# EAGLE design [Kirim Panut] Beton Ajek - Dirouting Faris (EAGLE 9.6.2)
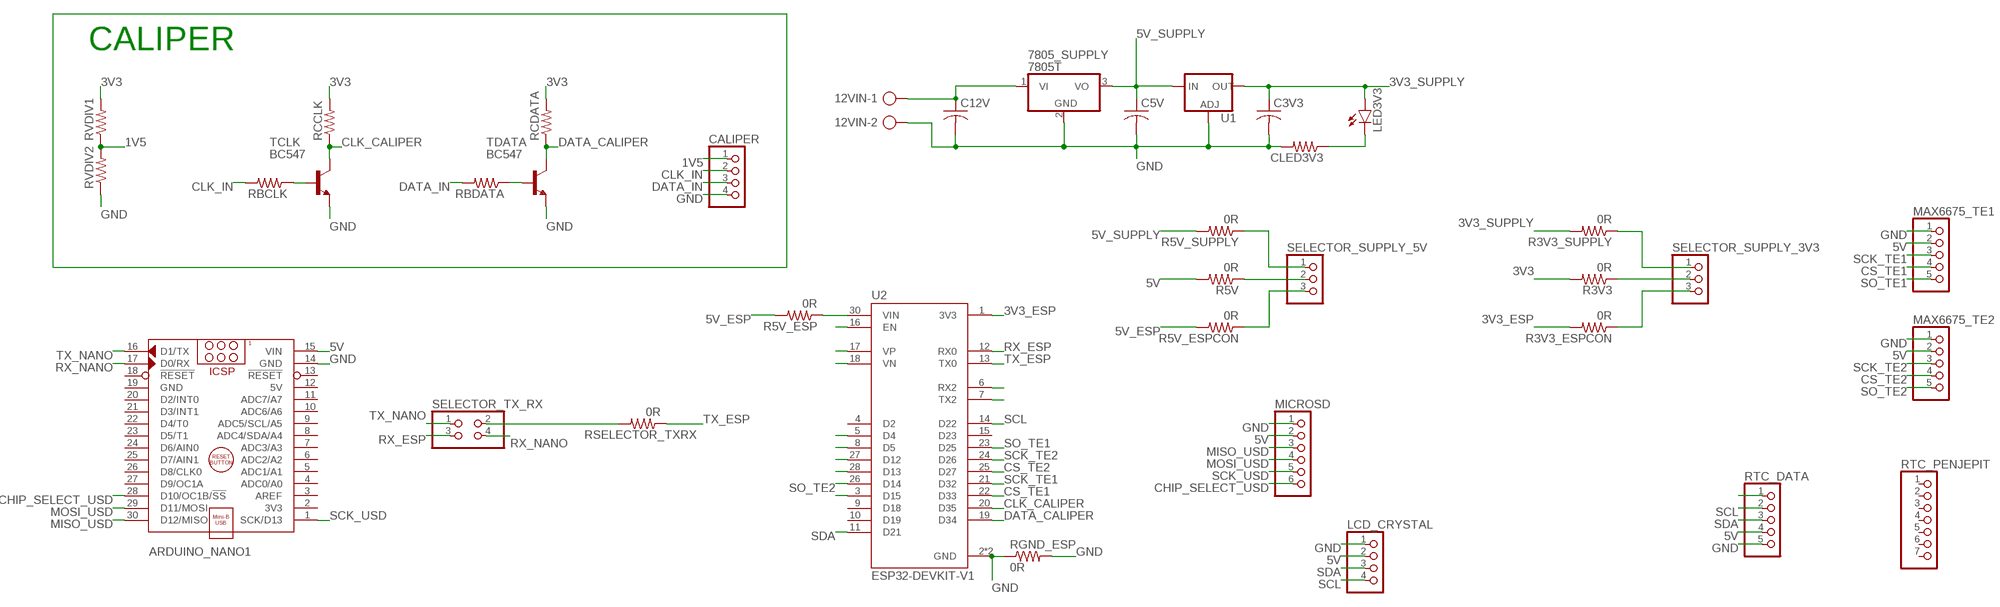
[diagram p0: schematic, sheet 1]

## Parts
12VIN  AK300/2  [AK300/2]
7805_SUPPLY  7805T  [TO220H]
ARDUINO_NANO1  ARDUINO_NANO  [ARDUINO_NANO]
C3V3  C-US075-032X103  [C075-032X103]
C5V  C-US075-032X103  [C075-032X103]
C12V  C-US075-032X103  [C075-032X103]
CALIPER  PINHD-1X4  [1X04]
CLED3V3  R-US_0207/10  [0207/10]
LCD_CRYSTAL  PINHD-1X4  [1X04]
LED3V3  LED5MM  [LED5MM]
MAX6675_TE1  PINHD-1X5  [1X05]
MAX6675_TE2  PINHD-1X5  [1X05]
MICROSD  PINHD-1X6  [1X06]
R3V3  0R  R-US_0207/10  [0207/10]
R3V3_ESPCON  0R  R-US_0207/10  [0207/10]
R3V3_SUPPLY  0R  R-US_0207/10  [0207/10]
R5V  0R  R-US_0207/10  [0207/10]
R5V_ESP  0R  R-US_0207/10  [0207/10]
R5V_ESPCON  0R  R-US_0207/10  [0207/10]
R5V_SUPPLY  0R  R-US_0207/10  [0207/10]
RBCLK  R-US_0207/10  [0207/10]
RBDATA  R-US_0207/10  [0207/10]
RCCLK  R-US_0207/10  [0207/10]
RCDATA  R-US_0207/10  [0207/10]
RGND_ESP  0R  R-US_0207/15  [0207/15]
RSELECTOR_TXRX  0R  R-US_0207/10  [0207/10]
RTC_DATA  PINHD-1X5  [1X05]
RTC_PENJEPIT  PINHD-1X7  [1X07]
RVDIV1  R-US_0207/10  [0207/10]
RVDIV2  R-US_0207/10  [0207/10]
SELECTOR_SUPPLY_3V3  PINHD-1X3  [1X03]
SELECTOR_SUPPLY_5V  PINHD-1X3  [1X03]
SELECTOR_TX_RX  PINHD-2X2  [2X02]
TCLK  BC547  [TO92]
TDATA  BC547  [TO92]
U1  V_REG_LM1117SOT223  [SOT223]
U2  ESP32-DEVKIT-V1  [MODULE_ESP32_DEVKIT_V1]

## Nets
1V5: CALIPER.1 RVDIV1.1 RVDIV2.2
3V3: R3V3.2 RCCLK.2 RCDATA.2 RVDIV1.2
3V3_ESP: R3V3_ESPCON.2 U2.1(3V3)
3V3_SUPPLY: C3V3.1 LED3V3.A R3V3_SUPPLY.2 U1.2(OUT) U1.4(OUT)
5V: ARDUINO_NANO1.15(VIN) LCD_CRYSTAL.2 MAX6675_TE1.2 MAX6675_TE2.2 MICROSD.2 R5V.2 RTC_DATA.4
5V_ESP: R5V_ESP.2 R5V_ESPCON.2
5V_SUPPLY: 7805_SUPPLY.3(VO) C5V.1 R5V_SUPPLY.2 U1.3(IN)
CHIP_SELECT_USD: ARDUINO_NANO1.28(D10/OC1B/!SS) MICROSD.6
CLK_CALIPER: RCCLK.1 TCLK.3(C) U2.20(D35)
CLK_IN: CALIPER.2 RBCLK.2
CS_TE1: MAX6675_TE1.4 U2.22(D33)
CS_TE2: MAX6675_TE2.4 U2.25(D27)
DATA_CALIPER: RCDATA.1 TDATA.3(C) U2.19(D34)
DATA_IN: CALIPER.3 RBDATA.2
GND: 12VIN.2 7805_SUPPLY.2(GND) ARDUINO_NANO1.14(GND) C3V3.2 C5V.2 C12V.2 CALIPER.4 CLED3V3.2 LCD_CRYSTAL.1 MAX6675_TE1.1 MAX6675_TE2.1 MICROSD.1 RGND_ESP.1 RGND_ESP.2 RTC_DATA.5 RVDIV2.1 TCLK.1(E) TDATA.1(E) U1.1(ADJ) U2.2(GND) U2.29(GND)
MISO_USD: ARDUINO_NANO1.30(D12/MISO) MICROSD.3
MOSI_USD: ARDUINO_NANO1.29(D11/MOSI) MICROSD.4
N$1: 12VIN.1 7805_SUPPLY.1(VI) C12V.1
N$2: RBCLK.1 TCLK.2(B)
N$4: RSELECTOR_TXRX.2 SELECTOR_TX_RX.2
N$6: R5V_ESP.1 U2.30(VIN)
N$7: R5V.1 SELECTOR_SUPPLY_5V.2
N$8: U2.16(EN)
N$9: U2.17(VP)
N$10: U2.18(VN)
N$11: R5V_SUPPLY.1 SELECTOR_SUPPLY_5V.1
N$12: U2.5(D4)
N$13: CLED3V3.1 LED3V3.K(C)
N$14: R5V_ESPCON.1 SELECTOR_SUPPLY_5V.3
N$15: R3V3.1 SELECTOR_SUPPLY_3V3.2
N$16: R3V3_SUPPLY.1 SELECTOR_SUPPLY_3V3.1
N$17: U2.8(D5)
N$18: RBDATA.1 TDATA.2(B)
N$19: U2.27(D12)
N$20: U2.28(D13)
N$21: R3V3_ESPCON.1 SELECTOR_SUPPLY_3V3.3
N$25: U2.3(D15)
N$39: U2.7(TX2)
N$40: U2.6(RX2)
N$52: RTC_DATA.1
RX_ESP: SELECTOR_TX_RX.3 U2.12(RX0)
RX_NANO: ARDUINO_NANO1.17(D0/RX) SELECTOR_TX_RX.4
SCK_TE1: MAX6675_TE1.3 U2.21(D32)
SCK_TE2: MAX6675_TE2.3 U2.24(D26)
SCK_USD: ARDUINO_NANO1.1(SCK/D13) MICROSD.5
SCL: LCD_CRYSTAL.4 RTC_DATA.2 U2.14(D22)
SDA: LCD_CRYSTAL.3 RTC_DATA.3 U2.11(D21)
SO_TE1: MAX6675_TE1.5 U2.23(D25)
SO_TE2: MAX6675_TE2.5 U2.26(D14)
TX_ESP: RSELECTOR_TXRX.1 U2.13(TX0)
TX_NANO: ARDUINO_NANO1.16(D1/TX) SELECTOR_TX_RX.1
Unconnected: ARDUINO_NANO1.2(3V3) ARDUINO_NANO1.3(AREF) ARDUINO_NANO1.4(ADC0/A0) ARDUINO_NANO1.5(ADC1/A1) ARDUINO_NANO1.6(ADC2/A2) ARDUINO_NANO1.7(ADC3/A3) ARDUINO_NANO1.8(ADC4/SDA/A4) ARDUINO_NANO1.9(ADC5/SCL/A5) ARDUINO_NANO1.10(ADC6/A6) ARDUINO_NANO1.11(ADC7/A7) ARDUINO_NANO1.13(!RESET) ARDUINO_NANO1.18(!RESET) ARDUINO_NANO1.20(D2/INT0) ARDUINO_NANO1.21(D3/INT1) ARDUINO_NANO1.22(D4/T0) ARDUINO_NANO1.23(D5/T1) ARDUINO_NANO1.24(D6/AIN0) ARDUINO_NANO1.25(D7/AIN1) ARDUINO_NANO1.26(D8/CLK0) ARDUINO_NANO1.27(D9/OC1A) RTC_PENJEPIT.1 RTC_PENJEPIT.2 RTC_PENJEPIT.3 RTC_PENJEPIT.4 RTC_PENJEPIT.5 RTC_PENJEPIT.6 RTC_PENJEPIT.7 U2.4(D2) U2.9(D18) U2.10(D19) U2.15(D23)

## Notes on the sheet
- CALIPER

## Power pins joined to a net without a drawn wire
5V: ARDUINO_NANO1.12(5V)
GND: ARDUINO_NANO1.19(GND)

## Library data of the parts
12VIN = con-ptr500:AK300/2: CONNECTOR
7805_SUPPLY = adafruit:78*: Positive VOLTAGE REGULATOR Added bigger pads to the TO-92 package
ARDUINO_NANO1 = ArduinoNanoV30:ARDUINO_NANO: Arduino Nano V3.0 Module Overview: The Arduino Nano is a small, complete, and breadboard-friendly board based on the ATmega328 (Arduino Nano 3.x) or ATmega168 (Arduino Nano 2.x). It has more or less the same functionality of the Arduino Duemilanove, but in a different package. It lacks only a DC power jack, and works with a Mini-B USB cable instead of a standard one. The Nano was designed and is being produced by Gravitech <http://www.gravitech.us/arna30wiatp.html>. General specifications: Item Value Microcontroller Atmel ATmega168 or ATmega328 Operating Voltage (logic level) 5 V Input Voltage (recommended) 7-12 V Input Voltage (limits) 6-20 V Digital I/O Pins 14 (of which 6 provide PWM output) Analog Input Pins 8 DC Current per I/O Pin 40 mA Flash Memory 16 KB (ATmega168) or 32 KB (ATmega328) of which 2 KB used by bootloader SRAM 1 KB (ATmega168) or 2 KB (ATmega328) EEPROM 512 bytes (ATmega168) or 1 KB (ATmega328) Clock Speed 16 MHz Dimensions (Inches) 0.73" x 1.70" Dimensions (mm) 18mm x 45mm Overall height About 9 mm (not including pins) Weigth 5 g Power: The Arduino Nano can be powered via the Mini-B USB connection, 6-20V unregulated external power supply (pin 30), or 5V regulated external power supply (pin 27). The power source is automatically selected to the highest voltage source. Memory: The ATmega168 has 16 KB of flash memory for storing code (of which 2 KB is used for the bootloader); the ATmega328 has 32 KB, (also with 2 KB used for the bootloader). The ATmega168 has 1 KB of SRAM and 512 bytes of EEPROM (which can be read and written with the EEPROM library); the ATmega328 has 2 KB of SRAM and 1 KB of EEPROM. Input and Output: Each of the 14 digital pins on the Nano can be used as an input or output, using pinMode(), digitalWrite(), and digitalRead() functions. They operate at 5 volts. Each pin can provide or receive a maximum of 40 mA and has an internal pull-up resistor (disconnected by default) of 20-50 kOhms. In addition, some pins have specialized functions. Visit Arduino - ArduinoBoardNano <https://www.arduino.cc/en/Main/ArduinoBoardNano>
C3V3 C5V C12V = rcl:C-US: CAPACITOR, American symbol; SPICEPREFIX: C
CALIPER LCD_CRYSTAL = pinhead:PINHD-1X4: PIN HEADER
CLED3V3 R3V3 R3V3_ESPCON R3V3_SUPPLY R5V R5V_ESP R5V_ESPCON R5V_SUPPLY RBCLK RBDATA RCCLK RCDATA RGND_ESP RSELECTOR_TXRX RVDIV1 RVDIV2 = rcl:R-US_: RESISTOR, American symbol; SPICEPREFIX: R
LED3V3 = led:LED: LED OSRAM: - CHIPLED LG R971, LG N971, LY N971, LG Q971, LY Q971, LO R971, LY R971 LH N974, LH R974 LS Q976, LO Q976, LY Q976 LO Q996 - Hyper CHIPLED LW Q18S LB Q993, LB Q99A, LB R99A - SideLED LS A670, LO A670, LY A670, LG A670, LP A670 LB A673, LV A673, LT A673, LW A673 LH A674 LY A675 LS A676, LA A676, LO A676, LY A676, LW A676 LS A679, LY A679, LG A679 - Hyper Micro SIDELED® LS Y876, LA Y876, LO Y876, LY Y876 LT Y87S - SmartLED LW L88C, LW L88S LB L89C, LB L89S, LG L890 LS L89K, LO L89K, LY L89K LS L896, LA L896, LO L896, LY L896 - TOPLED LS T670, LO T670, LY T670, LG T670, LP T670 LSG T670, LSP T670, LSY T670, LOP T670, LYG T670 LG T671, LOG T671, LSG T671 LB T673, LV T673, LT T673, LW T673 LH T674 LS T676, LA T676, LO T676, LY T676, LB T676, LH T676, LSB T676, LW T676 LB T67C, LV T67C, LT T67C, LS T67K, LO T67K, LY T67K, LW E67C LS E67B, LA E67B, LO E67B, LY E67B, LB E67C, LV E67C, LT E67C LW T67C LS T679, LY T679, LG T679 LS T770, LO T770, LY T770, LG T770, LP T770 LB T773, LV T773, LT T773, LW T773 LH T774 LS E675, LA E675, LY E675, LS T675 LS T776, LA T776, LO T776, LY T776, LB T776 LHGB T686 LT T68C, LB T68C - Hyper Mini TOPLED® LB M676 - Mini TOPLED Santana® LG M470 LS M47K, LO M47K, LY M47K Source: http://www.osram.convergy.de LUXEON: - LUMILED® LXK2-PW12-R00, LXK2-PW12-S00, LXK2-PW14-U00, LXK2-PW14-V00 LXK2-PM12-R00, LXK2-PM12-S00, LXK2-PM14-U00 LXK2-PE12-Q00, LXK2-PE12-R00, LXK2-PE12-S00, LXK2-PE14-T00, LXK2-PE14-U00 LXK2-PB12-K00, LXK2-PB12-L00, LXK2-PB12-M00, LXK2-PB14-N00, LXK2-PB14-P00, LXK2-PB14-Q00 LXK2-PR12-L00, LXK2-PR12-M00, LXK2-PR14-Q00, LXK2-PR14-R00 LXK2-PD12-Q00, LXK2-PD12-R00, LXK2-PD12-S00 LXK2-PH12-R00, LXK2-PH12-S00 LXK2-PL12-P00, LXK2-PL12-Q00, LXK2-PL12-R00 Source: www.luxeon.com KINGBRIGHT: KA-3528ASYC Source: www.kingbright.com
MAX6675_TE1 MAX6675_TE2 RTC_DATA = pinhead:PINHD-1X5: PIN HEADER
MICROSD = pinhead:PINHD-1X6: PIN HEADER
RTC_PENJEPIT = pinhead:PINHD-1X7: PIN HEADER
SELECTOR_SUPPLY_3V3 SELECTOR_SUPPLY_5V = pinhead:PINHD-1X3: PIN HEADER
SELECTOR_TX_RX = pinhead:PINHD-2X2: PIN HEADER
TCLK TDATA = transistor:BC547: NPN TRANSISTOR
U1 = SparkFun-IC-Power:V_REG_LM1117: Voltage Regulator LM1117 Standard adjustable voltage regulator but in SMD form. Spark Fun Electronics SKU : COM-00595; PROD_ID: VREG-08170
U2 = ESP32-DEVKIT-V1:ESP32-DEVKIT-V1: Dual core, Wi-Fi: 2.4 GHz up to 150 Mbits/s,BLE (Bluetooth Low Energy) and legacy Bluetooth, 32 bits, Up to 240 MHz Check availability <https://pricing.snapeda.com/parts/ESP32-DEVKIT-V1/Do%20it/view-part?ref=eda>; AVAILABILITY: Not in stock; DESCRIPTION: Dual core, Wi-Fi: 2.4 GHz up to 150 Mbits/s,BLE (Bluetooth Low Energy) and legacy Bluetooth, 32 bits, Up to 240 MHz; MF: Do it; MP: ESP32-DEVKIT-V1; PACKAGE: None; PRICE: None

## Board
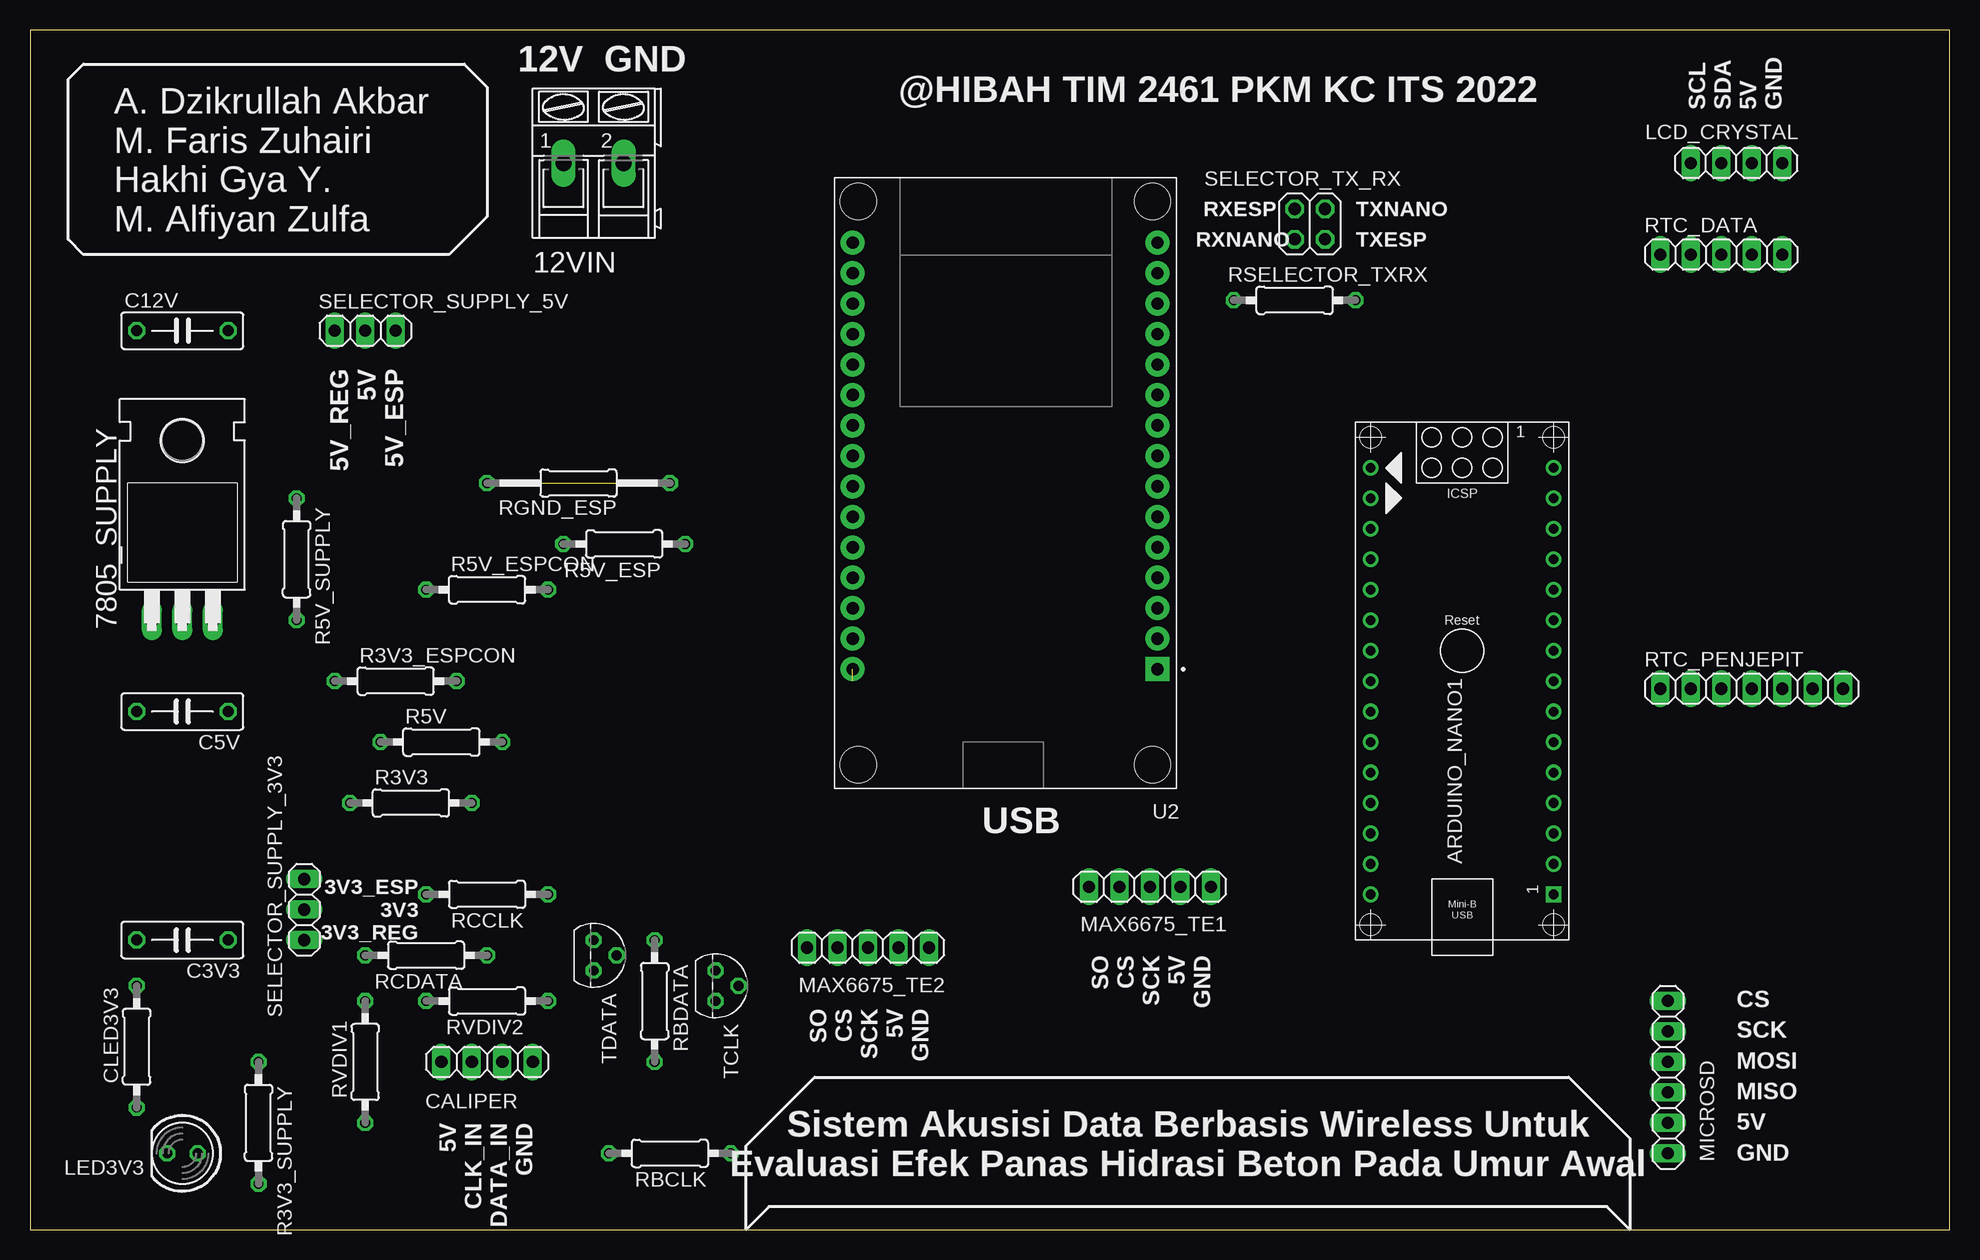
[diagram p1: board, top side]
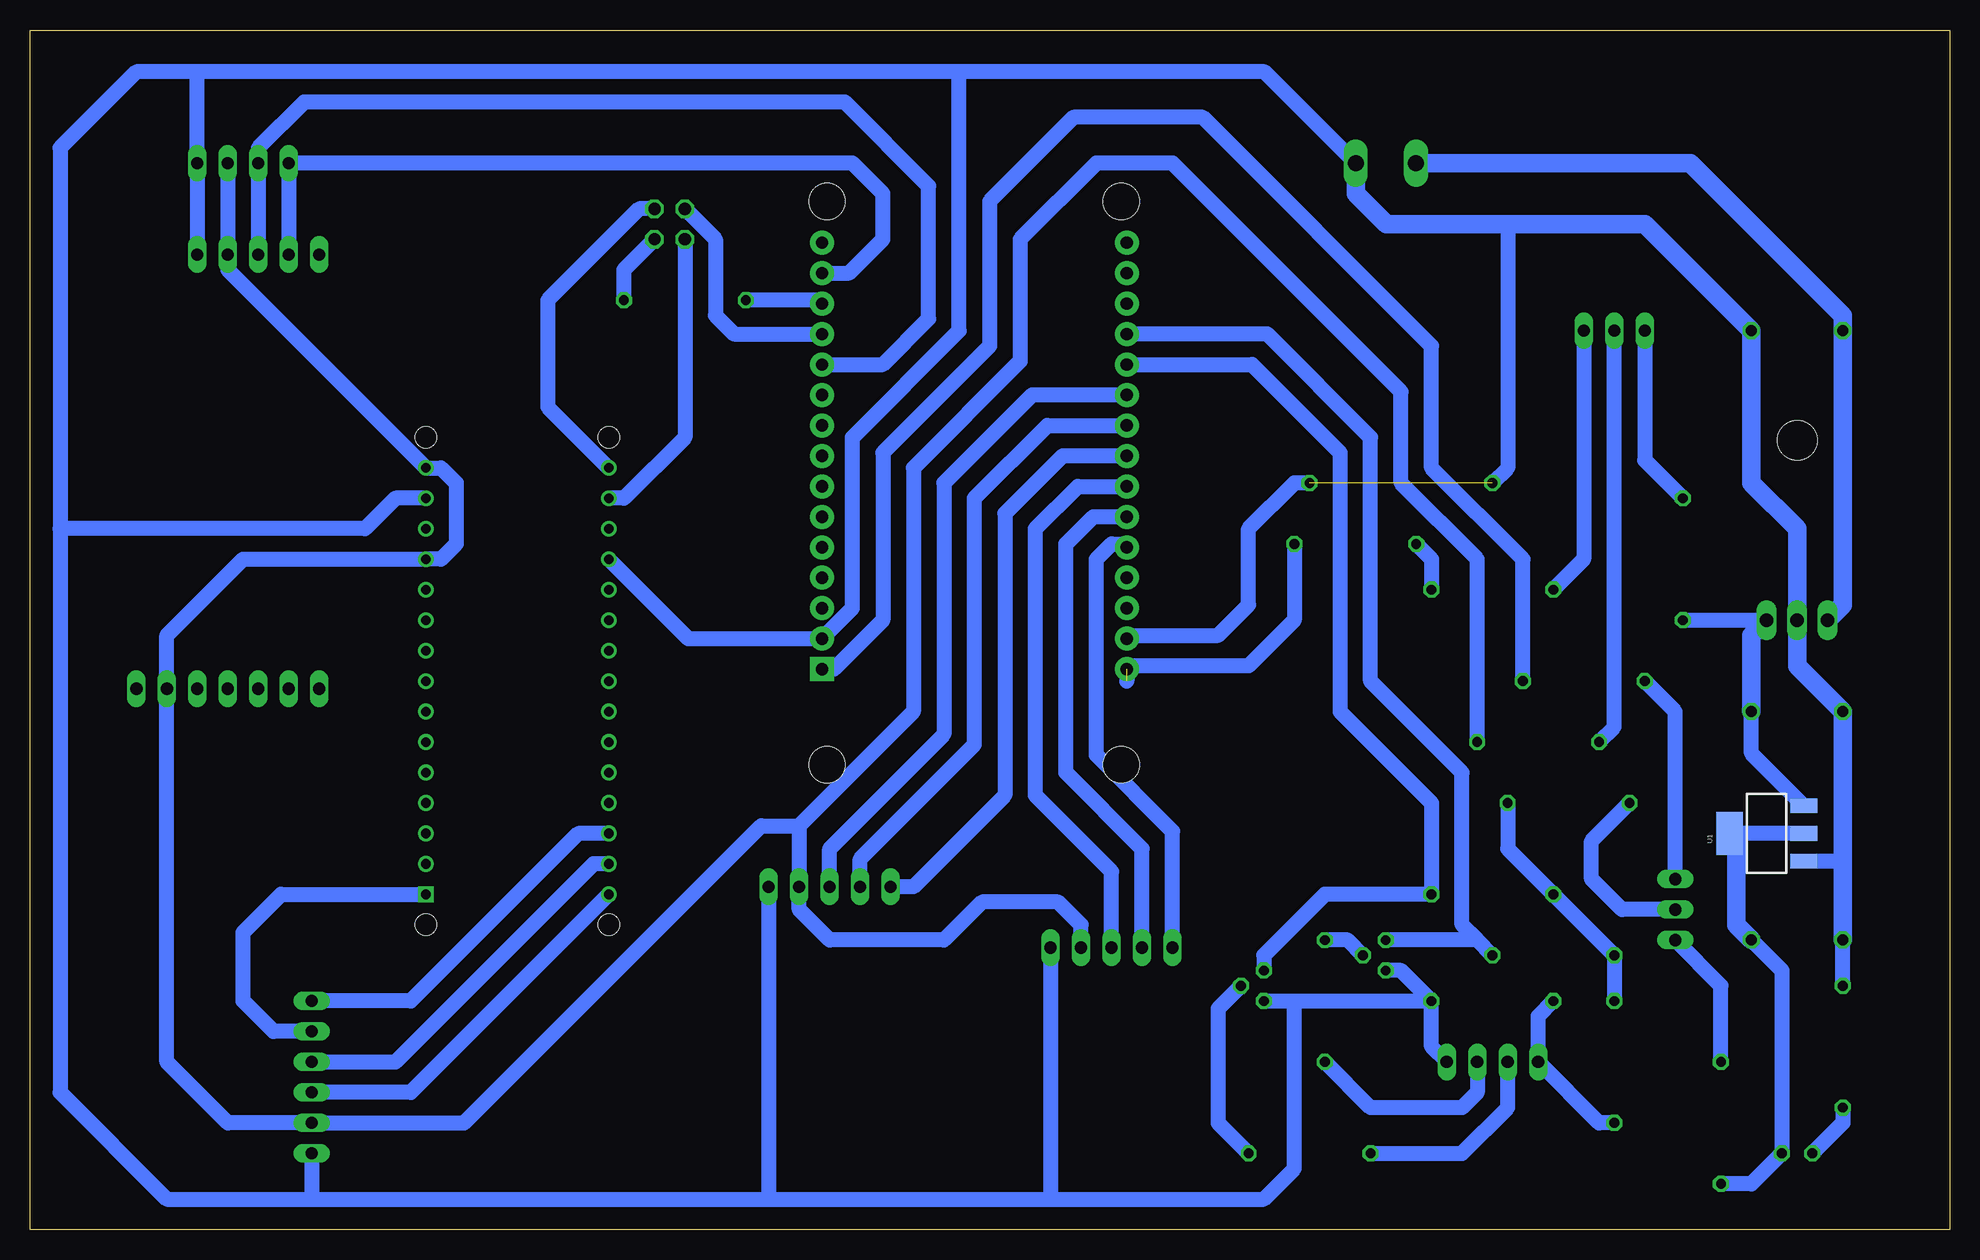
[diagram p2: board, bottom side, seen from below]

Size 160 x 100 mm. Coordinates in mm from the lower left corner, seen from the top.
Outline: 0,0 160,0 160,100 0,100 0,0
Copper layers (1*16): Top 0.035mm / dielectric 1.5mm / Bottom 0.035mm
Design rules "default": minimum track width 6mil, minimum drill 0.35mm, track to track 6mil, track to pad 6mil, pad to pad 6mil, via to via 6mil, smd to smd 6mil, copper to edge 40mil, drill to drill 6mil, minimum pad ring 10mil, minimum via ring 8mil, stop-mask expansion 4mil, vias tented up to drill 0mil, thermal gap 10mil

### Footprints (pad centres in the part's own frame; a part is rotated, then mirrored left to right if it is on the bottom)
AK300/2 = drill 1.321 long: 1 -2.515,0; 2 2.489,0
TO220H = drill 1.118 long: 1 -2.54,-10.16; 2 0,-10.16; 3 2.54,-10.16 | hole 3.302: 0,4.826
ARDUINO_NANO = drill 0.8 square: 1 -20.32,-7.62 | drill 0.8: 2 -17.78,-7.62; 3 -15.24,-7.62; 4 -12.7,-7.62; 5 -10.16,-7.62; 6 -7.62,-7.62; 7 -5.08,-7.62; 8 -2.54,-7.62; 9 0,-7.62; 10 2.54,-7.62; 11 5.08,-7.62; 12 7.62,-7.62; 13 10.16,-7.62; 14 12.7,-7.62; 15 15.24,-7.62; 16 15.24,7.62; 17 12.7,7.62; 18 10.16,7.62; 19 7.62,7.62; 20 5.08,7.62; 21 2.54,7.62; 22 0,7.62; 23 -2.54,7.62; 24 -5.08,7.62; 25 -7.62,7.62; 26 -10.16,7.62; 27 -12.7,7.62; 28 -15.24,7.62; 29 -17.78,7.62; 30 -20.32,7.62 | hole 1.778: -22.86,-7.62; -22.86,7.62; 17.78,7.62; 17.78,-7.62
C075-032X103 = drill 0.914 octagon: 1 -3.81,0; 2 3.81,0
1X04 = drill 1.016 long: 1 -3.81,0; 2 -1.27,0; 3 1.27,0; 4 3.81,0
0207/10 = drill 0.813 octagon: 1 -5.08,0; 2 5.08,0
LED5MM = drill 0.813 octagon: A -1.27,0; K 1.27,0
1X05 = drill 1.016 long: 1 -5.08,0; 2 -2.54,0; 3 0,0; 4 2.54,0; 5 5.08,0
1X06 = drill 1.016 long: 1 -6.35,0; 2 -3.81,0; 3 -1.27,0; 4 1.27,0; 5 3.81,0; 6 6.35,0
0207/15 = drill 0.813 octagon: 1 -7.62,0; 2 7.62,0
1X07 = drill 1.016 long: 1 -7.62,0; 2 -5.08,0; 3 -2.54,0; 4 0,0; 5 2.54,0; 6 5.08,0; 7 7.62,0
1X03 = drill 1.016 long: 1 -2.54,0; 2 0,0; 3 2.54,0
2X02 = drill 1.016 octagon: 1 -1.27,-1.27; 2 -1.27,1.27; 3 1.27,-1.27; 4 1.27,1.27
TO92 = drill 0.813 octagon: 1 1.27,0; 2 0,1.905; 3 -1.27,0
SOT223 = smd 1.219 x 2.235: 1 -2.311,-3.099; 2 0,-3.099; 3 2.311,-3.099 | smd 3.6 x 2.2: 4 0,3.099
MODULE_ESP32_DEVKIT_V1 = drill 1.02 pad 2 square: 1 -12.7,15.515 | drill 1.02 pad 2: 2 -12.7,12.975; 3 -12.7,10.435; 4 -12.7,7.895; 5 -12.7,5.355; 6 -12.7,2.815; 7 -12.7,0.275; 8 -12.7,-2.265; 9 -12.7,-4.805; 10 -12.7,-7.345; 11 -12.7,-9.885; 12 -12.7,-12.425; 13 -12.7,-14.965; 14 -12.7,-17.505; 15 -12.7,-20.045; 16 12.7,-20.045; 17 12.7,-17.505; 18 12.7,-14.965; 19 12.7,-12.425; 20 12.7,-9.885; 21 12.7,-7.345; 22 12.7,-4.805; 23 12.7,-2.265; 24 12.7,0.275; 25 12.7,2.815; 26 12.7,5.355; 27 12.7,7.895; 28 12.7,10.435; 29 12.7,12.975; 30 12.7,15.515 | hole 3: -12.28,-23.475; 12.23,-23.475; 12.23,23.475; -12.28,23.475

### Placement (x,y rotation side)
12VIN  46.99,88.9 0 top
7805_SUPPLY  12.7,60.96 0 top
ARDUINO_NANO1  119.38,48.26 90 top
C3V3  12.7,24.13 180 top
C5V  12.7,43.18 180 top
C12V  12.7,74.93 0 top
CALIPER  38.1,13.97 0 top
CLED3V3  8.89,15.24 90 top
LCD_CRYSTAL  142.24,88.9 180 top
LED3V3  12.7,6.35 180 top
MAX6675_TE1  93.34,28.57 180 top
MAX6675_TE2  69.85,23.5 180 top
MICROSD  136.53,12.7 90 top
R3V3  31.75,35.56 0 top
R3V3_ESPCON  30.48,45.72 0 top
R3V3_SUPPLY  19.05,8.89 270 top
R5V  34.29,40.64 0 top
R5V_ESP  49.53,57.15 180 top
R5V_ESPCON  38.1,53.34 0 top
R5V_SUPPLY  22.23,55.88 270 top
RBCLK  53.34,6.35 180 top
RBDATA  52.07,19.05 270 top
RCCLK  38.1,27.94 180 top
RCDATA  33.02,22.86 180 top
RGND_ESP  45.72,62.23 180 top
RSELECTOR_TXRX  105.41,77.47 0 top
RTC_DATA  140.97,81.28 0 top
RTC_PENJEPIT  143.51,45.09 0 top
RVDIV1  27.94,13.97 90 top
RVDIV2  38.1,19.05 180 top
SELECTOR_SUPPLY_3V3  22.86,26.67 90 top
SELECTOR_SUPPLY_5V  27.94,74.93 0 top
SELECTOR_TX_RX  106.68,83.82 180 top
TCLK  57.15,20.32 270 top
TDATA  46.99,22.86 270 top
U1  15.24,33.02 90 bottom
U2  81.28,62.23 180 top

### Tracks (layer width: path | path; a pad name or v marks a point on that pad's centre or on a via)
1V5
  Bottom 1.27: RVDIV1.1 29.21,8.89 CALIPER.1 34.29,17.78 RVDIV2.2
3V3
  Bottom 1.27: RVDIV1.2 RCDATA.2 RCCLK.2 36.83,31.75 R3V3.2
3V3_ESP
  Bottom 1.27: R3V3_ESPCON.2 35.56,55.88 43.18,63.5 43.18,73.66 62.23,92.71 73.03,92.71 80.01,85.72 80.01,73.66 88.9,64.77 88.9,50.8 92.98,46.72 U2.1
3V3_SUPPLY
  Bottom 1.27: U1.2 U1.4 | C3V3.1 13.97,21.59 LED3V3.A 16.51,3.81 R3V3_SUPPLY.2
  Bottom 1.524: C3V3.1 17.78,25.4 17.78,32.46 U1.4
5V
  Bottom 1.27: R5V.2 39.37,55.88 45.72,62.23 45.72,69.85 64.77,88.9 71.12,88.9 77.47,82.55 77.47,72.39 86.36,63.5 86.36,43.18 95.89,33.66 | LCD_CRYSTAL.2 RTC_DATA.4 143.51,80.01 ARDUINO_NANO1.15 125.73,63.5 124.46,62.23 124.46,57.15 125.73,55.88 ARDUINO_NANO1.12 142.24,55.88 148.59,49.53 148.59,13.97 143.51,8.89 MICROSD.2 123.83,8.89 99.06,33.66 95.89,33.66 | 95.89,33.66 MAX6675_TE1.2 95.89,26.67 93.34,24.13 83.82,24.13 80.64,27.3 74.3,27.3 72.39,25.4 MAX6675_TE2.2
5V_ESP
  Bottom 1.27: R5V_ESP.2 43.18,55.88 R5V_ESPCON.2
5V_SUPPLY
  Bottom 1.27: U1.3 16.51,39.7 C5V.1 | R5V_SUPPLY.2 7805_SUPPLY.3
  Bottom 1.524: C5V.1 16.51,49.53 7805_SUPPLY.3
CHIP_SELECT_USD
  Bottom 1.27: ARDUINO_NANO1.28 114.3,33.02 128.27,19.05 MICROSD.6
CLK_CALIPER
  Bottom 1.27: TCLK.3 57.15,22.86 52.07,27.94 RCCLK.1 43.18,35.56 50.8,43.18 50.8,64.77 58.15,72.11 U2.20
CLK_IN
  Bottom 1.27: RBCLK.2 40.64,6.35 36.83,10.16 CALIPER.2
CS_TE1
  Bottom 1.27: MAX6675_TE1.4 90.81,30.89 81.28,40.42 81.28,60.96 75.2,67.03 U2.22
CS_TE2
  Bottom 1.27: U2.25 71.39,59.41 73.66,57.15 73.66,38.1 67.31,31.75 MAX6675_TE2.4
DATA_CALIPER
  Bottom 1.27: RCDATA.1 39.37,24.13 | 39.37,24.13 TDATA.3 | 39.37,24.13 40.64,25.4 40.64,38.1 48.26,45.72 48.26,66.04 56.88,74.66 U2.19
DATA_IN
  Bottom 1.27: CALIPER.3 39.37,11.43 40.64,10.16 48.26,10.16 RBDATA.2
GND  (1 unrouted)
  Bottom 1.27: U1.1 9.12,30.71 8.89,30.48 | CLED3V3.2 C3V3.2 | CALIPER.4 43.18,15.24 RVDIV2.1 | RVDIV2.1 45.72,21.59 TDATA.1 | TCLK.1 54.61,19.05 | 54.61,19.05 RVDIV2.1 | 12VIN.2 57.1,96.52 82.55,96.52 | 82.55,96.52 146.05,96.52 | 146.05,96.52 151.13,96.52 157.48,90.17 157.48,58.42 | 136.53,2.54 148.59,2.54 157.48,11.43 157.48,58.42 | 136.53,2.54 98.42,2.54 | 98.42,2.54 74.93,2.54 | 74.93,2.54 57.15,2.54 54.61,5.08 54.61,19.05 | 36.83,83.82 36.83,63.5 RGND_ESP.2 | MAX6675_TE2.1 74.93,2.54 | U2.29 68.31,49.53 60.96,49.53 58.42,52.07 58.42,58.42 54.61,62.23 RGND_ESP.1 | RTC_DATA.5 LCD_CRYSTAL.1 146.05,96.52 | 82.55,96.52 82.55,74.93 91.44,66.04 91.44,51.8 U2.2 105.14,49.26 ARDUINO_NANO1.19 | MICROSD.1 136.53,2.54 | ARDUINO_NANO1.14 129.54,60.96 132.08,58.42 157.48,58.42 | MAX6675_TE1.1 98.42,2.54
  Bottom 1.524: 12VIN.2 49.48,86.36 46.94,83.82 36.83,83.82 25.4,83.82 C12V.2 16.51,62.23 12.7,58.42 7805_SUPPLY.2 12.7,46.99 C5V.2 8.89,30.48 C3V3.2
MISO_USD
  Bottom 1.27: MICROSD.3 128.27,11.43 ARDUINO_NANO1.30
MOSI_USD
  Bottom 1.27: MICROSD.4 129.54,13.97 113.03,30.48 ARDUINO_NANO1.29
N$1
  Bottom 1.524: 12VIN.1 21.61,88.9 8.89,76.17 C12V.1 8.89,52.07 7805_SUPPLY.1
N$2
  Bottom 1.27: TCLK.2 60.96,18.41 60.96,8.89 RBCLK.1
N$4
  Bottom 1.27: RSELECTOR_TXRX.2 110.49,80.01 SELECTOR_TX_RX.2
N$6  (1 unrouted)
  Bottom 1.27: R5V_ESP.1 54.61,50.8 58.42,46.99 68.58,46.99 68.58,45.72
N$7
  Bottom 1.27: SELECTOR_SUPPLY_5V.2 27.94,41.91 R5V.1
N$11
  Bottom 1.27: SELECTOR_SUPPLY_5V.1 25.4,64.14 R5V_SUPPLY.1
N$13
  Bottom 1.27: CLED3V3.1 8.89,8.89 LED3V3.K
N$14
  Bottom 1.27: SELECTOR_SUPPLY_5V.3 30.48,55.88 R5V_ESPCON.1
N$15
  Bottom 1.27: SELECTOR_SUPPLY_3V3.2 27.3,26.67 29.84,29.21 29.84,32.38 R3V3.1
N$16
  Bottom 1.27: R3V3_SUPPLY.1 19.05,20.32 SELECTOR_SUPPLY_3V3.1
N$18
  Bottom 1.27: TDATA.2 50.16,24.13 RBDATA.1
N$21
  Bottom 1.27: SELECTOR_SUPPLY_3V3.3 22.86,43.18 R3V3_ESPCON.1
RX_ESP
  Bottom 1.27: SELECTOR_TX_RX.3 102.87,82.55 102.87,76.2 101.33,74.66 U2.12
RX_NANO
  Bottom 1.27: ARDUINO_NANO1.17 110.49,60.96 105.41,66.04 SELECTOR_TX_RX.4
SCK_TE1
  Bottom 1.27: U2.21 76.47,69.58 83.82,62.23 83.82,41.27 93.34,31.75 MAX6675_TE1.3
SCK_TE2
  Bottom 1.27: MAX6675_TE2.3 69.85,29.84 76.2,36.2 76.2,58.42 72.67,61.95 U2.24
SCK_USD
  Bottom 1.27: MICROSD.5 139.7,16.51 142.24,19.05 142.24,24.77 139.06,27.94 ARDUINO_NANO1.1
SCL
  Bottom 1.27: RTC_DATA.2 LCD_CRYSTAL.4 91.44,88.9 88.9,86.36 88.9,82.55 91.72,79.73 U2.14
SDA
  Bottom 1.27: U2.11 88.9,72.11 85.09,75.92 85.09,87 92.08,93.98 137.16,93.98 140.97,90.17 LCD_CRYSTAL.3 RTC_DATA.3
SO_TE1
  Bottom 1.27: U2.23 73.94,64.5 78.74,59.69 78.74,36.2 86.36,28.57 MAX6675_TE1.5
SO_TE2
  Bottom 1.27: MAX6675_TE2.5 64.77,33.19 71.12,39.54 71.12,55.88 69.85,57.15 68.86,57.15 U2.26
TX_ESP
  Bottom 1.27: U2.13 94.25,77.47 RSELECTOR_TXRX.1
TX_NANO
  Bottom 1.27: SELECTOR_TX_RX.1 109.22,85.09 116.84,77.47 116.84,68.58 ARDUINO_NANO1.16

### Text on the board
tPlace: 12V GND | @HIBAH TIM 2461 PKM KC ITS 2022 | SCL / SDA / 5V / GND | RXESP | TXNANO | A. Dzikrullah Akbar / M. Faris Zuhairi / Hakhi Gya Y. / M. Alfiyan Zulfa | RXNANO | TXESP | 5V_REG / 5V / 5V_ESP | USB | 3V3_ESP / 3V3 / 3V3_REG | SO / CS / SCK / 5V / GND | SO / CS / SCK / 5V / GND | 5V / CLK_IN / DATA_IN / GND | CS / SCK / MOSI / MISO / 5V / GND | Sistem Akusisi Data Berbasis Wireless Untuk / Evaluasi Efek Panas Hidrasi Beton Pada Umur Awal